# Altium schematic sheet DSP.SCHDOC
size B
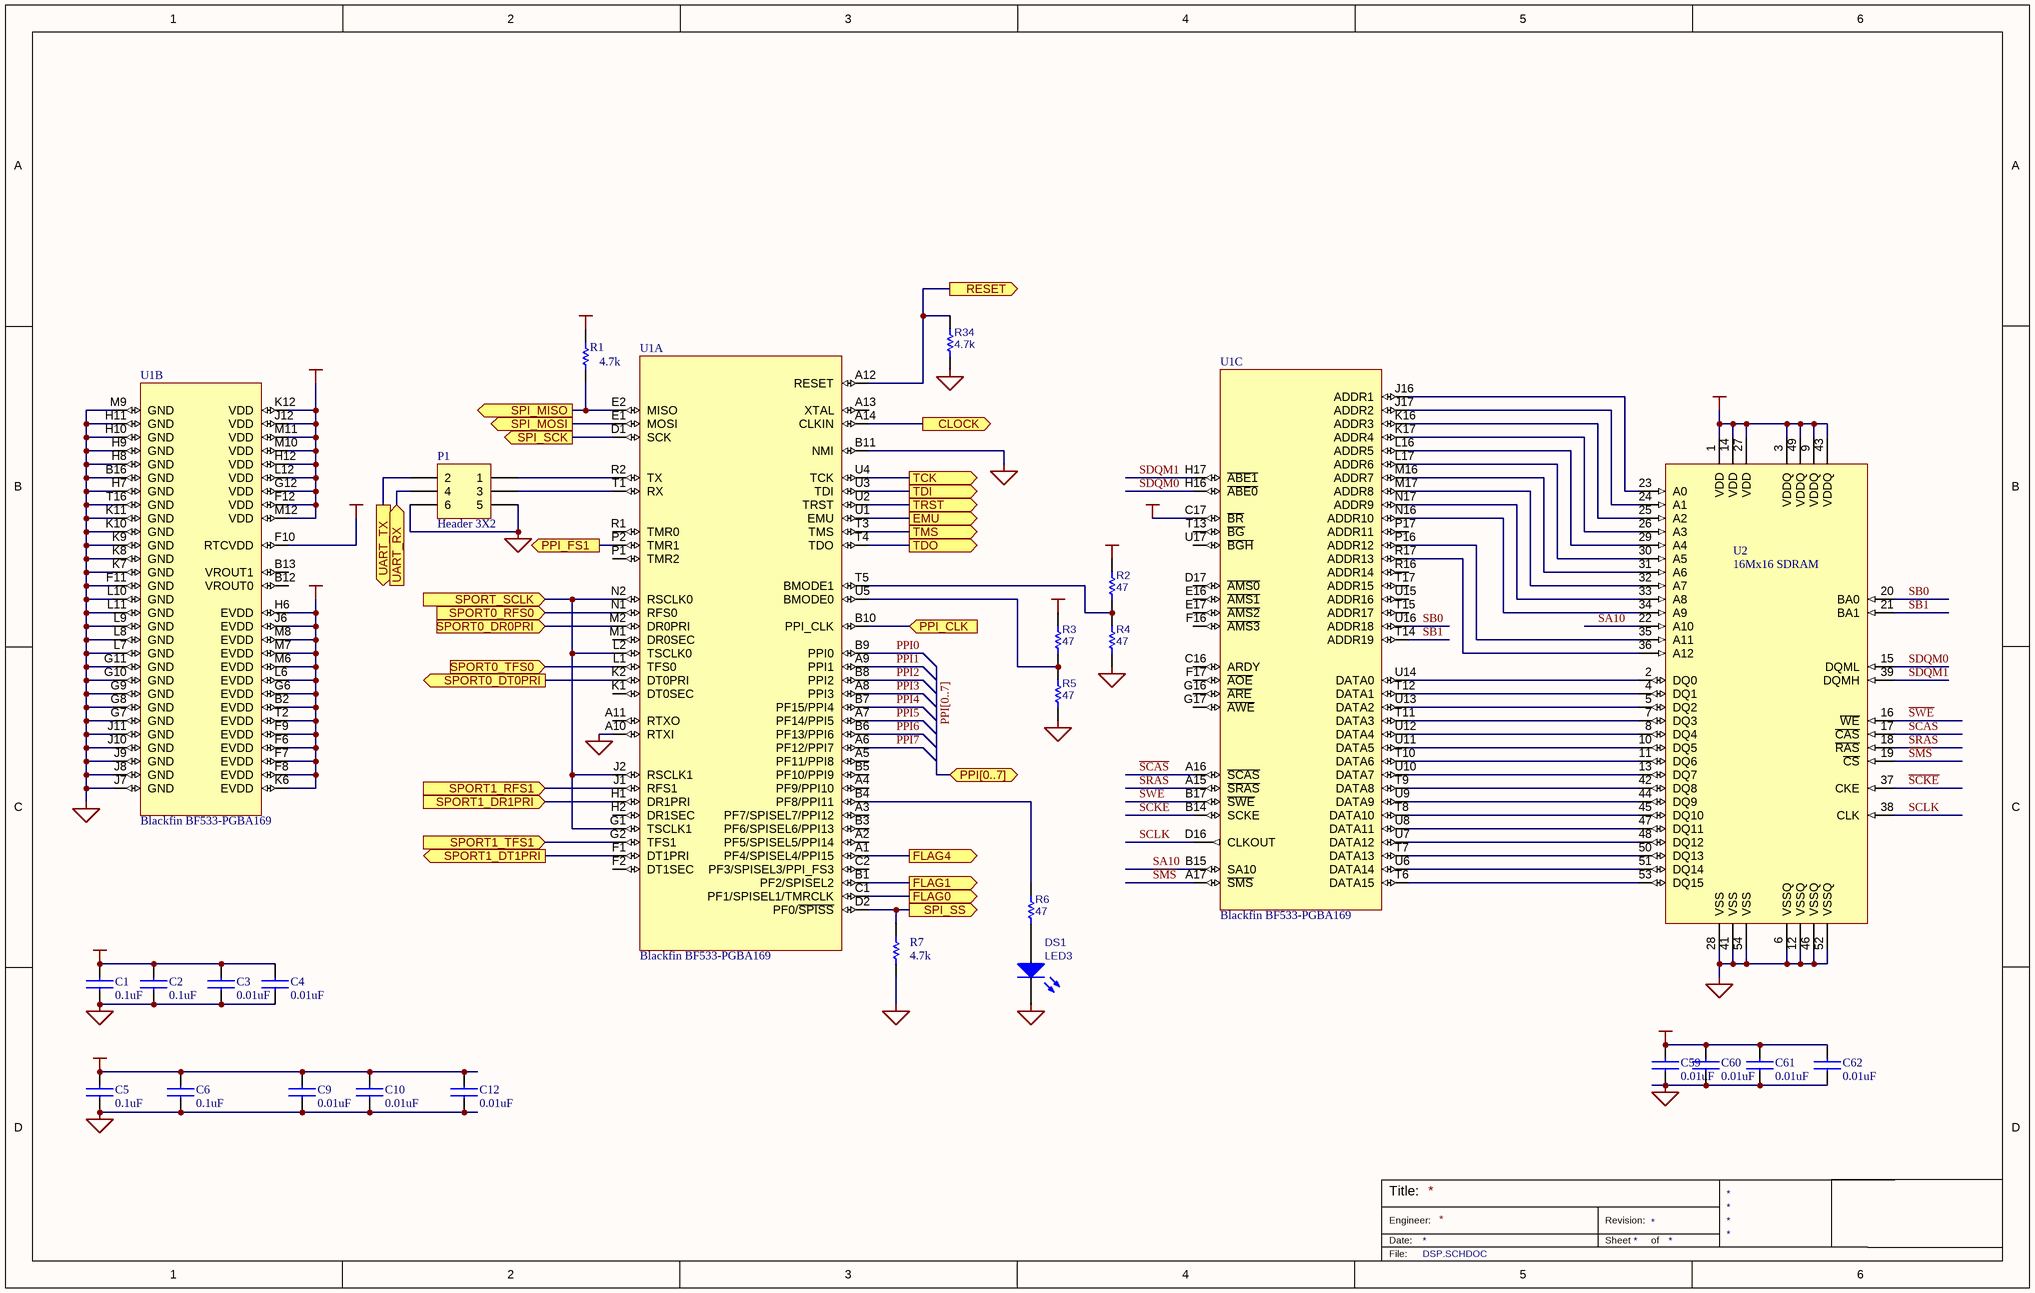
[diagram p0: DSP.SCHDOC]

## Parts
C1  value 0.1uF  [0603]  (hidden comment: CAPACITOR)
C2  value 0.1uF  [0603]  (hidden comment: CAPACITOR)
C3  value 0.01uF  [0402]  (hidden comment: CAPACITOR)
C4  value 0.01uF  [0402]  (hidden comment: CAPACITOR)
C5  value 0.1uF  [0603]  (hidden comment: CAPACITOR)
C6  value 0.1uF  [0603]  (hidden comment: CAPACITOR)
C9  value 0.01uF  [0402]  (hidden comment: CAPACITOR)
C10  value 0.01uF  [0402]  (hidden comment: CAPACITOR)
C12  value 0.01uF  [0402]  (hidden comment: CAPACITOR)
C59  value 0.01uF  [0402]  (hidden comment: CAPACITOR)
C60  value 0.01uF  [0402]  (hidden comment: CAPACITOR)
C61  value 0.01uF  [0402]  (hidden comment: CAPACITOR)
C62  value 0.01uF  [0402]  (hidden comment: CAPACITOR)
DS1  LED3  [LED0805]
P1  Header 3X2  [HDR2X3]
R1  value 4.7k  [0603]  (hidden comment: RESISTOR)
R2  value 47  [0603]  (hidden comment: RESISTOR)
R3  value 47  [0603]  (hidden comment: RESISTOR)
R4  value 47  [0603]  (hidden comment: RESISTOR)
R5  value 47  [0603]  (hidden comment: RESISTOR)
R6  value 47  [0603]  (hidden comment: RESISTOR)
R7  value 4.7k  [0603]  (hidden comment: RESISTOR)
R34  value 4.7k  [0603]  (hidden comment: RESISTOR)
U1  Blackfin BF533-PGBA169  [AD PBGA-169]  (parts A,B,C of 3)
U2  16Mx16 SDRAM  [SO-G54/X.5]

## Ports
CLOCK (out), EMU (out), FLAG0 (out), FLAG1 (out), FLAG4 (out), PPI[0..7] (bidir), PPI_CLK (in), PPI_FS1 (out), RESET (out), SPI_MISO (out), SPI_MOSI (out), SPI_SCK (out), SPI_SS (out), SPORT0_DR0PRI (in), SPORT0_DT0PRI (out), SPORT0_RFS0 (in), SPORT0_TFS0 (in), SPORT1_DR1PRI (in), SPORT1_DT1PRI (out), SPORT1_RFS1 (in), SPORT1_TFS1 (in), SPORT_SCLK (in), TCK (out), TDI (out), TDO (out), TMS (out), TRST (out), UART_RX (in), UART_TX (out)

## Nets
+1.2VCC: C1.2 C2.2 C3.2 C4.2 U1.F12(VDD) U1.G12(VDD) U1.H12(VDD) U1.J12(VDD) U1.K12(VDD) U1.L12(VDD) U1.M10(VDD) U1.M11(VDD) U1.M12(VDD)
GND: C1.1 C2.1 C3.1 C4.1 C5.1 C6.1 C9.1 C10.1 C12.1 C59.1 C60.1 C61.1 C62.1 DS1.2(K) P1.5 P1.6 R4.2 R5.2 R7.1 R34.2 U1.A10(RTXI) U1.B11(NMI) U1.B16(GND) U1.F11(GND) U1.G7(GND) U1.G8(GND) U1.G9(GND) U1.G10(GND) U1.G11(GND) U1.H7(GND) U1.H8(GND) U1.H9(GND) U1.H10(GND) U1.H11(GND) U1.J7(GND) U1.J8(GND) U1.J9(GND) U1.J10(GND) U1.J11(GND) U1.K7(GND) U1.K8(GND) U1.K9(GND) U1.K10(GND) U1.K11(GND) U1.L7(GND) U1.L8(GND) U1.L9(GND) U1.L10(GND) U1.L11(GND) U1.M9(GND) U1.T16(GND) U2.6(VSSQ) U2.12(VSSQ) U2.28(VSS) U2.41(VSS) U2.46(VSSQ) U2.52(VSSQ) U2.54(VSS)
VCC: C5.2 C6.2 C9.2 C10.2 C12.2 C59.2 C60.2 C61.2 C62.2 R1.2 R2.1 R3.1 U1.B2(EVDD) U1.C17(~{BR}) U1.F6(EVDD) U1.F7(EVDD) U1.F8(EVDD) U1.F9(EVDD) U1.F10(RTCVDD) U1.G6(EVDD) U1.H6(EVDD) U1.J6(EVDD) U1.K6(EVDD) U1.L6(EVDD) U1.M6(EVDD) U1.M7(EVDD) U1.M8(EVDD) U1.T2(EVDD) U2.1(VDD) U2.3(VDDQ) U2.9(VDDQ) U2.14(VDD) U2.27(VDD) U2.43(VDDQ) U2.49(VDDQ)
CLOCK: U1.A14(CLKIN) ; port CLOCK
EMU: U1.U1(EMU) ; port EMU
FLAG0: U1.C1(PF1/SPISEL1/TMRCLK) ; port FLAG0
FLAG1: U1.B1(PF2/SPISEL2) ; port FLAG1
FLAG4: U1.A1(PF4/SPISEL4/PPI15) ; port FLAG4
PPI0: U1.B9(PPI0)
PPI1: U1.A9(PPI1)
PPI2: U1.B8(PPI2)
PPI3: U1.A8(PPI3)
PPI4: U1.B7(PF15/PPI4)
PPI5: U1.A7(PF14/PPI5)
PPI6: U1.B6(PF13/PPI6)
PPI7: U1.A6(PF12/PPI7)
PPI_CLK: U1.B10(PPI_CLK) ; port PPI_CLK
PPI_FS1: U1.P2(TMR1) ; port PPI_FS1
RESET: R34.1 U1.A12(RESET) ; port RESET
~{SCAS}: U1.A16(~{SCAS}) U2.17(~{CAS})
~{SCKE}: U1.B14(SCKE) U2.37(CKE)
~{SMS}: U1.A17(~{SMS}) U2.19(~{CS})
~{SRAS}: U1.A15(~{SRAS}) U2.18(~{RAS})
~{SWE}: U1.B17(~{SWE}) U2.16(~{WE})
SA10: U1.B15(SA10) U2.22(A10)
SB0: U1.U16(ADDR18) U2.20(BA0)
SB1: U1.T14(ADDR19) U2.21(BA1)
SCLK: U1.D16(CLKOUT) U2.38(CLK)
SDQM0: U1.H16(~{ABE0}) U2.15(DQML)
SDQM1: U1.H17(~{ABE1}) U2.39(DQMH)
SPI_MISO: R1.1 U1.E2(MISO) ; port SPI_MISO
SPI_MOSI: U1.E1(MOSI) ; port SPI_MOSI
SPI_SCK: U1.D1(SCK) ; port SPI_SCK
SPI_SS: R7.2 U1.D2(PF0/~{SPISS}) ; port SPI_SS
SPORT0_DR0PRI: U1.M2(DR0PRI) ; port SPORT0_DR0PRI
SPORT0_DT0PRI: U1.K2(DT0PRI) ; port SPORT0_DT0PRI
SPORT0_RFS0: U1.N1(RFS0) ; port SPORT0_RFS0
SPORT0_TFS0: U1.L1(TFS0) ; port SPORT0_TFS0
SPORT1_DR1PRI: U1.H1(DR1PRI) ; port SPORT1_DR1PRI
SPORT1_DT1PRI: U1.F1(DT1PRI) ; port SPORT1_DT1PRI
SPORT1_RFS1: U1.J1(RFS1) ; port SPORT1_RFS1
SPORT1_TFS1: U1.G2(TFS1) ; port SPORT1_TFS1
SPORT_SCLK: U1.G1(TSCLK1) U1.J2(RSCLK1) U1.L2(TSCLK0) U1.N2(RSCLK0) ; port SPORT_SCLK
TCK: U1.U4(TCK) ; port TCK
TDI: U1.U3(TDI) ; port TDI
TDO: U1.T4(TDO) ; port TDO
TMS: U1.T3(TMS) ; port TMS
TRST: U1.U2(TRST) ; port TRST
UART_RX: P1.4 ; port UART_RX
UART_TX: P1.2 ; port UART_TX
NetDS1_1: DS1.1(A) R6.2
NetP1_1: P1.1 U1.R2(TX)
NetP1_3: P1.3 U1.T1(RX)
NetR2_2: R2.2 R4.1 U1.T5(BMODE1)
NetR3_2: R3.2 R5.1 U1.U5(BMODE0)
NetR6_1: R6.1 U1.B4(PF8/PPI11)
NetU1_J16: U1.J16(ADDR1) U2.23(A0)
NetU1_J17: U1.J17(ADDR2) U2.24(A1)
NetU1_K16: U1.K16(ADDR3) U2.25(A2)
NetU1_K17: U1.K17(ADDR4) U2.26(A3)
NetU1_L16: U1.L16(ADDR5) U2.29(A4)
NetU1_L17: U1.L17(ADDR6) U2.30(A5)
NetU1_M16: U1.M16(ADDR7) U2.31(A6)
NetU1_M17: U1.M17(ADDR8) U2.32(A7)
NetU1_N16: U1.N16(ADDR10) U2.34(A9)
NetU1_N17: U1.N17(ADDR9) U2.33(A8)
NetU1_P16: U1.P16(ADDR12) U2.35(A11)
NetU1_R17: U1.R17(ADDR13) U2.36(A12)
NetU1_T6: U1.T6(DATA15) U2.53(DQ15)
NetU1_T7: U1.T7(DATA13) U2.50(DQ13)
NetU1_T8: U1.T8(DATA10) U2.45(DQ10)
NetU1_T9: U1.T9(DATA8) U2.42(DQ8)
NetU1_T10: U1.T10(DATA6) U2.11(DQ6)
NetU1_T11: U1.T11(DATA3) U2.7(DQ3)
NetU1_T12: U1.T12(DATA1) U2.4(DQ1)
NetU1_U6: U1.U6(DATA14) U2.51(DQ14)
NetU1_U7: U1.U7(DATA12) U2.48(DQ12)
NetU1_U8: U1.U8(DATA11) U2.47(DQ11)
NetU1_U9: U1.U9(DATA9) U2.44(DQ9)
NetU1_U10: U1.U10(DATA7) U2.13(DQ7)
NetU1_U11: U1.U11(DATA5) U2.10(DQ5)
NetU1_U12: U1.U12(DATA4) U2.8(DQ4)
NetU1_U13: U1.U13(DATA2) U2.5(DQ2)
NetU1_U14: U1.U14(DATA0) U2.2(DQ0)

Not connected (* = marked no-connect by the designer): U1 A2(PF5/SPISEL5/PPI14) A3(PF7/SPISEL7/PPI12) A4(PF9/PPI10) A5(PF11/PPI8) A11(RTXO) A13(XTAL) B3(PF6/SPISEL6/PPI13) B5(PF10/PPI9) B12(VROUT0) B13(VROUT1) C2(PF3/SPISEL3/PPI_FS3) C16(ARDY) D17(~{AMS0}) E16(~{AMS1}) E17(~{AMS2}) F2(DT1SEC) F16(~{AMS3}) F17(~{AOE}) G16(~{ARE}) G17(~{AWE}) H2(DR1SEC) K1(DT0SEC) M1(DR0SEC) P1(TMR2) P17(ADDR11) R1(TMR0) R16(ADDR14) T13(~{BG}) T15(ADDR17) T17(ADDR15) U15(ADDR16) U17(~{BGH})

## Buses and harness runs
bus PPI[0..7] = port PPI[0..7]

## Notes on the sheet
- Title:
- Engineer:
- Date:
- Revision:
- Sheet
- of
- File:

## Library data of the parts
C1-C6 C9 C10 C12 C59-C62 = CAPACITOR: Standard Capacitor
DS1 = LED3: Typical BLUE SiC LED; Published: 8-Jun-2000; LatestRevisionDate: 17-Dec-2003; LatestRevisionNote: PCB Footprint replaced.; Publisher: Altium Limited
P1 = Header 3X2: Header, 3-Pin, Dual row; LatestRevisionDate: 17-Jul-2002; LatestRevisionNote: Re-released for DXP Platform.; Publisher: Altium Limited
R1-R7 R34 = RESISTOR: Standard Passive Resistor; Tolerance: 1%
U1 = ADSP-BF53x-PBGA169: Analog Devices Blackfin
U2 = MT48LC16M16A2TG: Micron 16Mbitx16 SDRAM